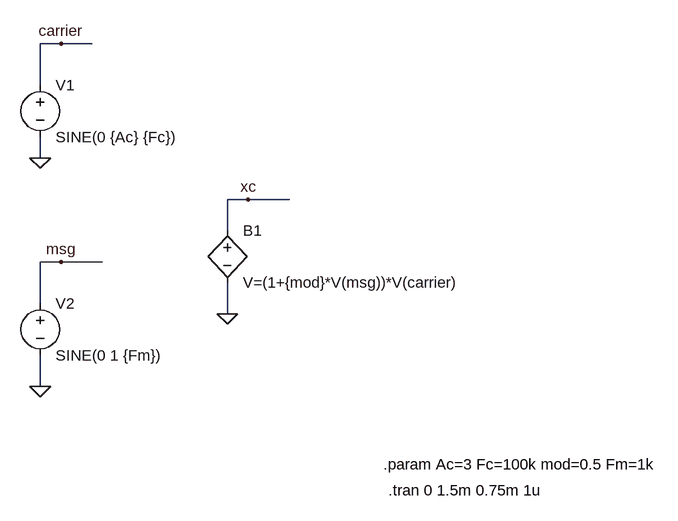
[diagram p0: schematic lab5.asc]
lab5.asc, the LTspice schematic file:
Version 4
SHEET 1 944 912
WIRE -16 208 -48 208
WIRE 32 208 -16 208
WIRE -48 272 -48 208
WIRE -48 384 -48 352
WIRE 272 448 240 448
WIRE 336 448 272 448
WIRE 240 496 240 448
WIRE -16 544 -48 544
WIRE 48 544 -16 544
WIRE -48 608 -48 544
WIRE 240 624 240 576
WIRE -48 736 -48 688
FLAG -48 384 0
FLAG -16 208 carrier
FLAG -48 736 0
FLAG -16 544 msg
FLAG 240 624 0
FLAG 272 448 xc
SYMBOL voltage -48 256 R0
WINDOW 123 0 0 Left 0
WINDOW 39 0 0 Left 0
SYMATTR InstName V1
SYMATTR Value SINE(0 {Ac} {Fc})
SYMBOL voltage -48 592 R0
WINDOW 123 0 0 Left 0
WINDOW 39 0 0 Left 0
SYMATTR InstName V2
SYMATTR Value SINE(0 1 {Fm})
SYMBOL bv 240 480 R0
SYMATTR InstName B1
SYMATTR Value V=(1+{mod}*V(msg))*V(carrier)
TEXT 480 856 Left 2 !.param Ac=3 Fc=100k mod=0.5 Fm=1k
TEXT 488 896 Left 2 !.tran 0 1.5m 0.75m 1u

The netlist it stands for:
* lab5.asc
V1 carrier 0 SINE(0 {Ac} {Fc})
V2 msg 0 SINE(0 1 {Fm})
B1 xc 0 V=(1+{mod}*V(msg))*V(carrier)
.param Ac=3 Fc=100k mod=0.5 Fm=1k
.tran 0 1.5m 0.75m 1u
.backanno
.end